# Altium project STM32F103T6C8_PI_Arath_v00.PrjPcb
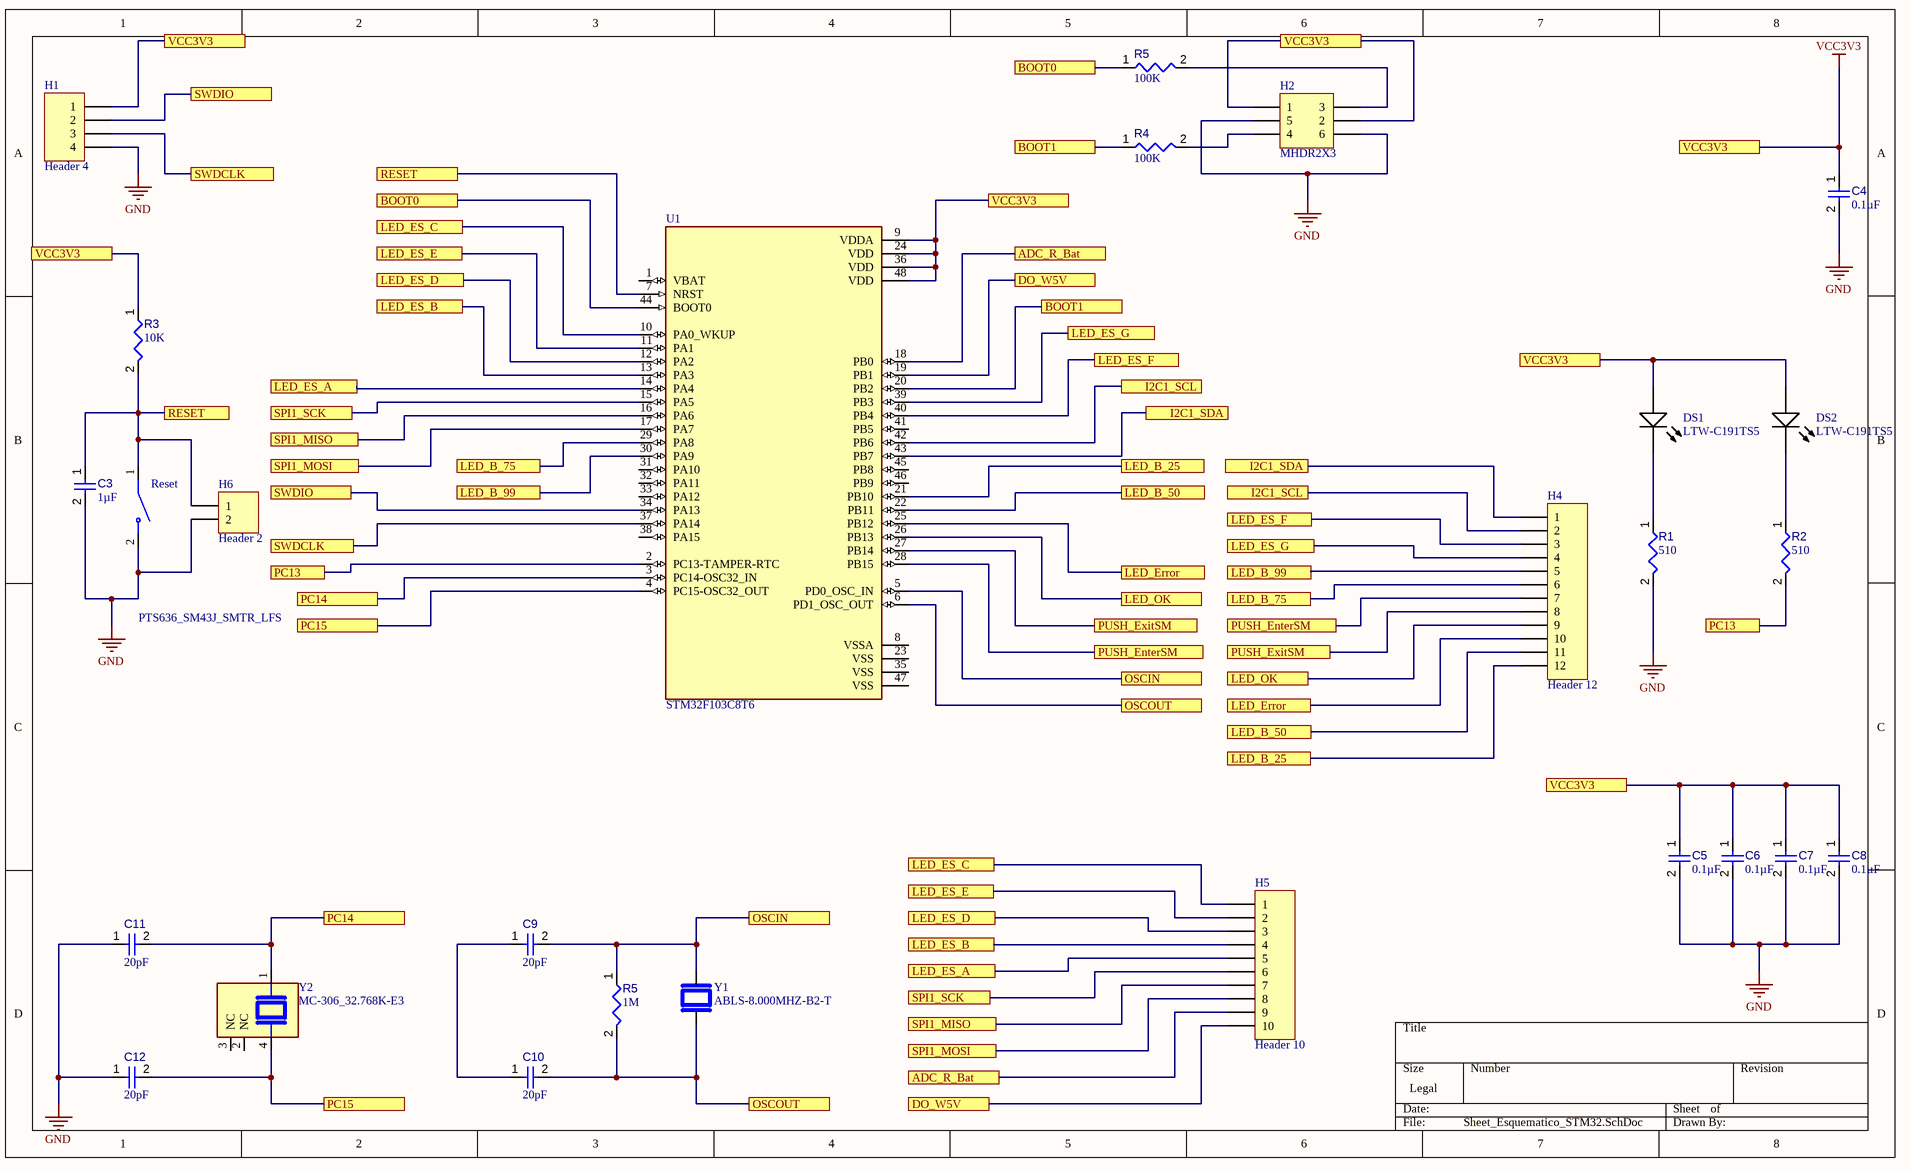
[diagram p0: Sheet_Esquematico_STM32.SchDoc]
1 sheet, 27 parts. Net scope: flat (ports and power ports of the same name join across sheets).
Board file: PCB_PlacaIndividual_v00_.PcbDoc

## Sheet Sheet_Esquematico_STM32.SchDoc
size Legal; SheetNumber: 1; SheetTotal: 1

### Parts
(Parts that share a designator on the sheet are numbered #1, #2 ... from top to bottom, then left to right.)
C3  value 1µF  [CAPC0603(1608)100_L]  (hidden comment: Capacitor 10µF +/-20% 10V 0603)
C4  value 0.1µF  [CAPC0603(1608)100_L]  (hidden comment: Capacitor 10µF +/-20% 10V 0603)
C5  value 0.1µF  [CAPC0603(1608)100_L]  (hidden comment: Capacitor 10µF +/-20% 10V 0603)
C6  value 0.1µF  [CAPC0603(1608)100_L]  (hidden comment: Capacitor 10µF +/-20% 10V 0603)
C7  value 0.1µF  [CAPC0603(1608)100_L]  (hidden comment: Capacitor 10µF +/-20% 10V 0603)
C8  value 0.1µF  [CAPC0603(1608)100_L]  (hidden comment: Capacitor 10µF +/-20% 10V 0603)
C9  value 20pF  [CAPC0603(1608)100_L]  (hidden comment: Capacitor 10µF +/-20% 10V 0603)
C10  value 20pF  [CAPC0603(1608)100_L]  (hidden comment: Capacitor 10µF +/-20% 10V 0603)
C11  value 20pF  [CAPC0603(1608)100_L]  (hidden comment: Capacitor 10µF +/-20% 10V 0603)
C12  value 20pF  [CAPC0603(1608)100_L]  (hidden comment: Capacitor 10µF +/-20% 10V 0603)
DS1  LTW-C191TS5  [LTST-LTW-C191TS5_V]
DS2  LTW-C191TS5  [LTST-LTW-C191TS5_V]
H1  Header 4  [HDR1X4]
H2  MHDR2X3  [SW_219-3LPSTR]
H4  Header 12  [HDR1X12]
H5  Header 10  [HDR1X10]
H6  Header 2  [HDR1X2]
R1  value 510  [RESC1608X55X25ML10T15]  (hidden comment: Resistor 10k +/-1% 0603 100 mW)
R2  value 510  [RESC1608X55X25ML10T15]  (hidden comment: Resistor 10k +/-1% 0603 100 mW)
R3  value 10K  [RESC1608X55X25ML10T15]  (hidden comment: Resistor 10k +/-1% 0603 100 mW)
R4  value 100K  [RESC1608X55X25ML10T15]  (hidden comment: Resistor 10k +/-1% 0603 100 mW)
R5#1  value 100K  [RESC1608X55X25ML10T15]  (hidden comment: Resistor 10k +/-1% 0603 100 mW)
R5#2  value 1M  [RESC1608X55X25ML10T15]  (hidden comment: Resistor 10k +/-1% 0603 100 mW)
Reset  PTS636_SM43J_SMTR_LFS  [SW_PTS636_SM43J_SMTR_LFS]
U1  STM32F103C8T6  [QFP50P900X900X160-48N]
Y1  ABLS-8.000MHZ-B2-T  [XTAL_ABLS-8.000MHZ-B2-T]
Y2  MC-306_32.768K-E3  [XTAL_MC-306_32.768K-E3]

### Ports
ADC_R_Bat (see Sheet_Esquematico_STM32[2D]), ADC_R_Bat (see Sheet_Esquematico_STM32[3A]), BOOT0 (see Sheet_Esquematico_STM32[1A]), BOOT0 (see Sheet_Esquematico_STM32[3A]), BOOT1 (see Sheet_Esquematico_STM32[3A]), BOOT1 (see Sheet_Esquematico_STM32[3B]), DO_W5V (see Sheet_Esquematico_STM32[2D]), DO_W5V (see Sheet_Esquematico_STM32[3A]), I2C1_SCL (see Sheet_Esquematico_STM32[3B]), I2C1_SDA (see Sheet_Esquematico_STM32[3B]), LED_B_25 (see Sheet_Esquematico_STM32[3B]), LED_B_25 (see Sheet_Esquematico_STM32[3C]), LED_B_50 (see Sheet_Esquematico_STM32[3B]), LED_B_50 (see Sheet_Esquematico_STM32[3C]), LED_B_75 (see Sheet_Esquematico_STM32[1B]), LED_B_75 (see Sheet_Esquematico_STM32[3C]), LED_B_99 (see Sheet_Esquematico_STM32[1B]), LED_B_99 (see Sheet_Esquematico_STM32[3B]), LED_Error (see Sheet_Esquematico_STM32[3B]), LED_Error (see Sheet_Esquematico_STM32[3C]), LED_ES_A (see Sheet_Esquematico_STM32[1B]), LED_ES_A (see Sheet_Esquematico_STM32[2D]), LED_ES_B (see Sheet_Esquematico_STM32[1B]), LED_ES_B (see Sheet_Esquematico_STM32[2D]), LED_ES_C (see Sheet_Esquematico_STM32[1A]), LED_ES_C (see Sheet_Esquematico_STM32[2C]), LED_ES_D (see Sheet_Esquematico_STM32[1A]), LED_ES_D (see Sheet_Esquematico_STM32[2D]), LED_ES_E (see Sheet_Esquematico_STM32[1A]), LED_ES_E (see Sheet_Esquematico_STM32[2D]), LED_ES_F (see Sheet_Esquematico_STM32[3B]), LED_ES_G (see Sheet_Esquematico_STM32[3B]), LED_OK (see Sheet_Esquematico_STM32[3C]), OSCIN (see Sheet_Esquematico_STM32[2D]), OSCIN (see Sheet_Esquematico_STM32[3C]), OSCOUT (see Sheet_Esquematico_STM32[2D]), OSCOUT (see Sheet_Esquematico_STM32[3C]), PC13 (see Sheet_Esquematico_STM32[1B]), PC13 (see Sheet_Esquematico_STM32[4C]), PC14 (see Sheet_Esquematico_STM32[1C]), PC14 (see Sheet_Esquematico_STM32[1D]), PC15 (see Sheet_Esquematico_STM32[1C]), PC15 (see Sheet_Esquematico_STM32[1D]), PUSH_EnterSM (see Sheet_Esquematico_STM32[3C]), PUSH_ExitSM (see Sheet_Esquematico_STM32[3C]), RESET (see Sheet_Esquematico_STM32[1A]), RESET (see Sheet_Esquematico_STM32[1B]), SPI1_MISO (see Sheet_Esquematico_STM32[1B]), SPI1_MISO (see Sheet_Esquematico_STM32[2D]), SPI1_MOSI (see Sheet_Esquematico_STM32[1B]), SPI1_MOSI (see Sheet_Esquematico_STM32[2D]), SPI1_SCK (see Sheet_Esquematico_STM32[1B]), SPI1_SCK (see Sheet_Esquematico_STM32[2D]), SWDCLK (see Sheet_Esquematico_STM32[1A]), SWDCLK (see Sheet_Esquematico_STM32[1B]), SWDIO (see Sheet_Esquematico_STM32[1A]), SWDIO (see Sheet_Esquematico_STM32[1B]), VCC3V3 (see Sheet_Esquematico_STM32[1A], Sheet_Esquematico_STM32[3A], Sheet_Esquematico_STM32[4A], Sheet_Esquematico_STM32[4B]), VCC3V3 (see Sheet_Esquematico_STM32[1A], Sheet_Esquematico_STM32[3A], Sheet_Esquematico_STM32[4A], Sheet_Esquematico_STM32[4B], Sheet_Esquematico_STM32[4C]), VCC3V3 (see Sheet_Esquematico_STM32[1A], Sheet_Esquematico_STM32[3A], Sheet_Esquematico_STM32[4A], Sheet_Esquematico_STM32[4C]), VCC3V3 (see Sheet_Esquematico_STM32[1A], Sheet_Esquematico_STM32[3A], Sheet_Esquematico_STM32[4B], Sheet_Esquematico_STM32[4C])

### Nets
GND: C3.2 C4.2 C5.2 C6.2 C7.2 C8.2 C11.1 C12.1 H1.4 H2.3(5) H2.6 H6.2 R1.2 Reset.2(NO)
VCC3V3: C4.1 C5.1 C6.1 C7.1 C8.1 DS1.1(A) DS2.1(A) H1.1 H2.1 H2.4(2) R3.1 U1.9(VDDA) U1.24(VDD) U1.36(VDD) U1.48(VDD) ; port VCC3V3
NetC3_1: C3.1 H6.1 R3.2 Reset.1(COM) U1.7(NRST) ; port RESET
NetC9_1: C9.1 C10.1
NetC9_2: C9.2 R5#2.1 U1.5(PD0_OSC_IN) Y1.1 ; port OSCIN
NetC10_2: C10.2 R5#2.2 U1.6(PD1_OSC_OUT) Y1.2 ; port OSCOUT
NetC11_2: C11.2 U1.3(PC14-OSC32_IN) Y2.1 ; port PC14
NetC12_2: C12.2 U1.4(PC15-OSC32_OUT) Y2.4 ; port PC15
NetDS1_2: DS1.2(K) R1.1
NetDS2_2: DS2.2(K) R2.1
NetH1_2: H1.2 U1.34(PA13) ; port SWDIO
NetH1_3: H1.3 U1.37(PA14) ; port SWDCLK
NetH2_2: H2.2(3) R5#1.2
NetH2_5: H2.5(4) R4.2
NetH4_1: H4.1 U1.43(PB7) ; port I2C1_SDA
NetH4_2: H4.2 U1.42(PB6) ; port I2C1_SCL
NetH4_3: H4.3 U1.40(PB4) ; port LED_ES_F
NetH4_4: H4.4 U1.39(PB3) ; port LED_ES_G
NetH4_5: H4.5 U1.30(PA9) ; port LED_B_99
NetH4_6: H4.6 U1.29(PA8) ; port LED_B_75
NetH4_7: H4.7 U1.28(PB15) ; port PUSH_EnterSM
NetH4_8: H4.8 U1.27(PB14) ; port PUSH_ExitSM
NetH4_9: H4.9 U1.26(PB13) ; port LED_OK
NetH4_10: H4.10 U1.25(PB12) ; port LED_Error
NetH4_11: H4.11 U1.22(PB11) ; port LED_B_50
NetH4_12: H4.12 U1.21(PB10) ; port LED_B_25
NetH5_1: H5.1 U1.10(PA0_WKUP) ; port LED_ES_C
NetH5_2: H5.2 U1.11(PA1) ; port LED_ES_E
NetH5_3: H5.3 U1.12(PA2) ; port LED_ES_D
NetH5_4: H5.4 U1.13(PA3) ; port LED_ES_B
NetH5_5: H5.5 U1.14(PA4) ; port LED_ES_A
NetH5_6: H5.6 U1.15(PA5) ; port SPI1_SCK
NetH5_7: H5.7 U1.16(PA6) ; port SPI1_MISO
NetH5_8: H5.8 U1.17(PA7) ; port SPI1_MOSI
NetH5_9: H5.9 U1.18(PB0) ; port ADC_R_Bat
NetH5_10: H5.10 U1.19(PB1) ; port DO_W5V
NetR2_2: R2.2 U1.2(PC13-TAMPER-RTC) ; port PC13
NetR4_1: R4.1 U1.20(PB2) ; port BOOT1
NetR5#1_1: R5#1.1 U1.44(BOOT0) ; port BOOT0

Not connected (* = marked no-connect by the designer): U1 1(VBAT) 8(VSSA) 23(VSS) 31(PA10) 32(PA11) 33(PA12) 35(VSS) 38(PA15) 41(PB5) 45(PB8) 46(PB9) 47(VSS); Y2 2(NC) 3(NC)

### Library data of the parts
C3-C12 = CMP-001-00075-4: Chip Capacitor, 10µF +/-20%, 10V, 0603, Thickness 1 mm; Tolerance: 10%; Voltage Rating: 10V; Max Operating Temperature: 85°C; Pins: 2; Case/Package: 0603; Mounting Technology: SMT; Min Operating Temperature: -55°C
DS1 DS2 = CMP-007-00027-2: LED Uni-Color White, 70 mW, 20 mA, -20 to 80 degC, 2-Pin SMD, RoHS, Tape and Reel; Manufacturer: Lite-On; Power: 70mW; Forward Current: 5mA; Viewing Angle: 130degrees; Luminous Intensity: 28mcd; Lens Style: Diffused; Nominal Vf: 2.93V; Forward Voltage: 3.15V; Pins: 2; Illumination Colour: White; Datasheet Version: Rev. B, 06/2010; Package Quantity: 1; Colour: White; Package Reference: LTW-C191TS5; Mounting Technology: SM; Package Description: 2-Pin Surface Mount Device, Body 1.6 x 0.8 mm; Manufacturer URL: http://www.us.liteon.com/; Datasheet URL: http://optoelectronics.liteon.com/upload/download/DS22-2004-201/S_110_LTW-C191TS5.pdf; Max Operating Temperature: 80°C; Case/Package: 0603; RoHS Compliant: True; Min Operating Temperature: -20°C; Packaging: TapeandReel
H1 = Header 4: Header, 4-Pin; LatestRevisionDate: 17-Jul-2002; LatestRevisionNote: Re-released for DXP Platform.; Publisher: Altium Limited
H2 = MHDR2X3: Header, 3-Pin, Dual row; LatestRevisionDate: 17-Jul-2002; LatestRevisionNote: Re-released for DXP Platform.; Publisher: Altium Limited
H4 = Header 12: Header, 12-Pin; LatestRevisionDate: 17-Jul-2002; LatestRevisionNote: Re-released for DXP Platform.; Publisher: Altium Limited
H5 = Header 10: Header, 10-Pin; LatestRevisionDate: 17-Jul-2002; LatestRevisionNote: Re-released for DXP Platform.; Publisher: Altium Limited
H6 = Header 2: Header, 2-Pin; LatestRevisionDate: 17-Jul-2002; LatestRevisionNote: Re-released for DXP Platform.; Publisher: Altium Limited
R1-R4 R5#1 R5#2 = CMP-009-00017-5: Chip Resistor, 10 KOhm, +/- 1%, 01 W, -55 to 155 degC, 0603 (1608 Metric); Voltage Rating: 50V; Power: 100mW; RoHS Compliant: True; Min Operating Temperature: -55°C; Pins: 2; Case/Package: 0603; Mounting Technology: SM; Max Operating Temperature: 155°C; Tolerance: 1%
Reset = PTS636_SM43J_SMTR_LFS: Tactile Switch SPST-NO Top Actuated Surface Mount; Price: None; Value: *; MP: PTS636_SM43J_SMTR_LFS; Package: None; Availability: Unavailable
U1 = STM32F103C8T6: ARM® Cortex®-M3 STM32F1 Microcontroller IC 32-Bit 72MHz 64KB (64K x 8) FLASH 48-LQFP (7x7); MF: STMicroelectronics; SnapEDA_Link: https://www.snapeda.com/parts/STM32F103C8T6/STMicroelectronics/view-part/?ref=snap; Package: LQFP-48 STMicroelectronics; Value: *; MP: STM32F103C8T6; Check_prices: https://www.snapeda.com/parts/STM32F103C8T6/STMicroelectronics/view-part/?ref=eda
Y1 = ABLS-8.000MHZ-B2-T: HC/49US (AT49) SMD LOW PROFILE CRYSTAL; MF: Abracon LLC; Availability: In Stock; Purchase-URL: https://pricing.snapeda.com/search/part/ABLS-8.000MHZ-B2-T/?ref=eda; Package: HC49/US Abracon; MP: ABLS-8.000MHZ-B2-T; Value: *; Check_prices: https://www.snapeda.com/parts/ABLS-8.000MHZ-B2-T/Abracon+LLC/view-part/?ref=eda; SnapEDA_Link: https://www.snapeda.com/parts/ABLS-8.000MHZ-B2-T/Abracon+LLC/view-part/?ref=snap; Price: None
Y2 = MC-306_32.768K-E3: CRYSTAL 32.7680KHZ 6PF SMD; MF: EPSON; MP: MC-306 32.768K-E3; Check_prices: https://www.snapeda.com/parts/MC-306%2032.768K-E3/EPSON/view-part/?ref=eda; Package: NON STANDARD-4 EPSON; Value: *; Price: None; Purchase-URL: https://pricing.snapeda.com/search/part/MC-306 32.768K-E3/?ref=eda; SnapEDA_Link: https://www.snapeda.com/parts/MC-306%2032.768K-E3/EPSON/view-part/?ref=snap; Availability: In Stock